# EAGLE design uart_debug_slave_2014 (EAGLE 6.5.0)
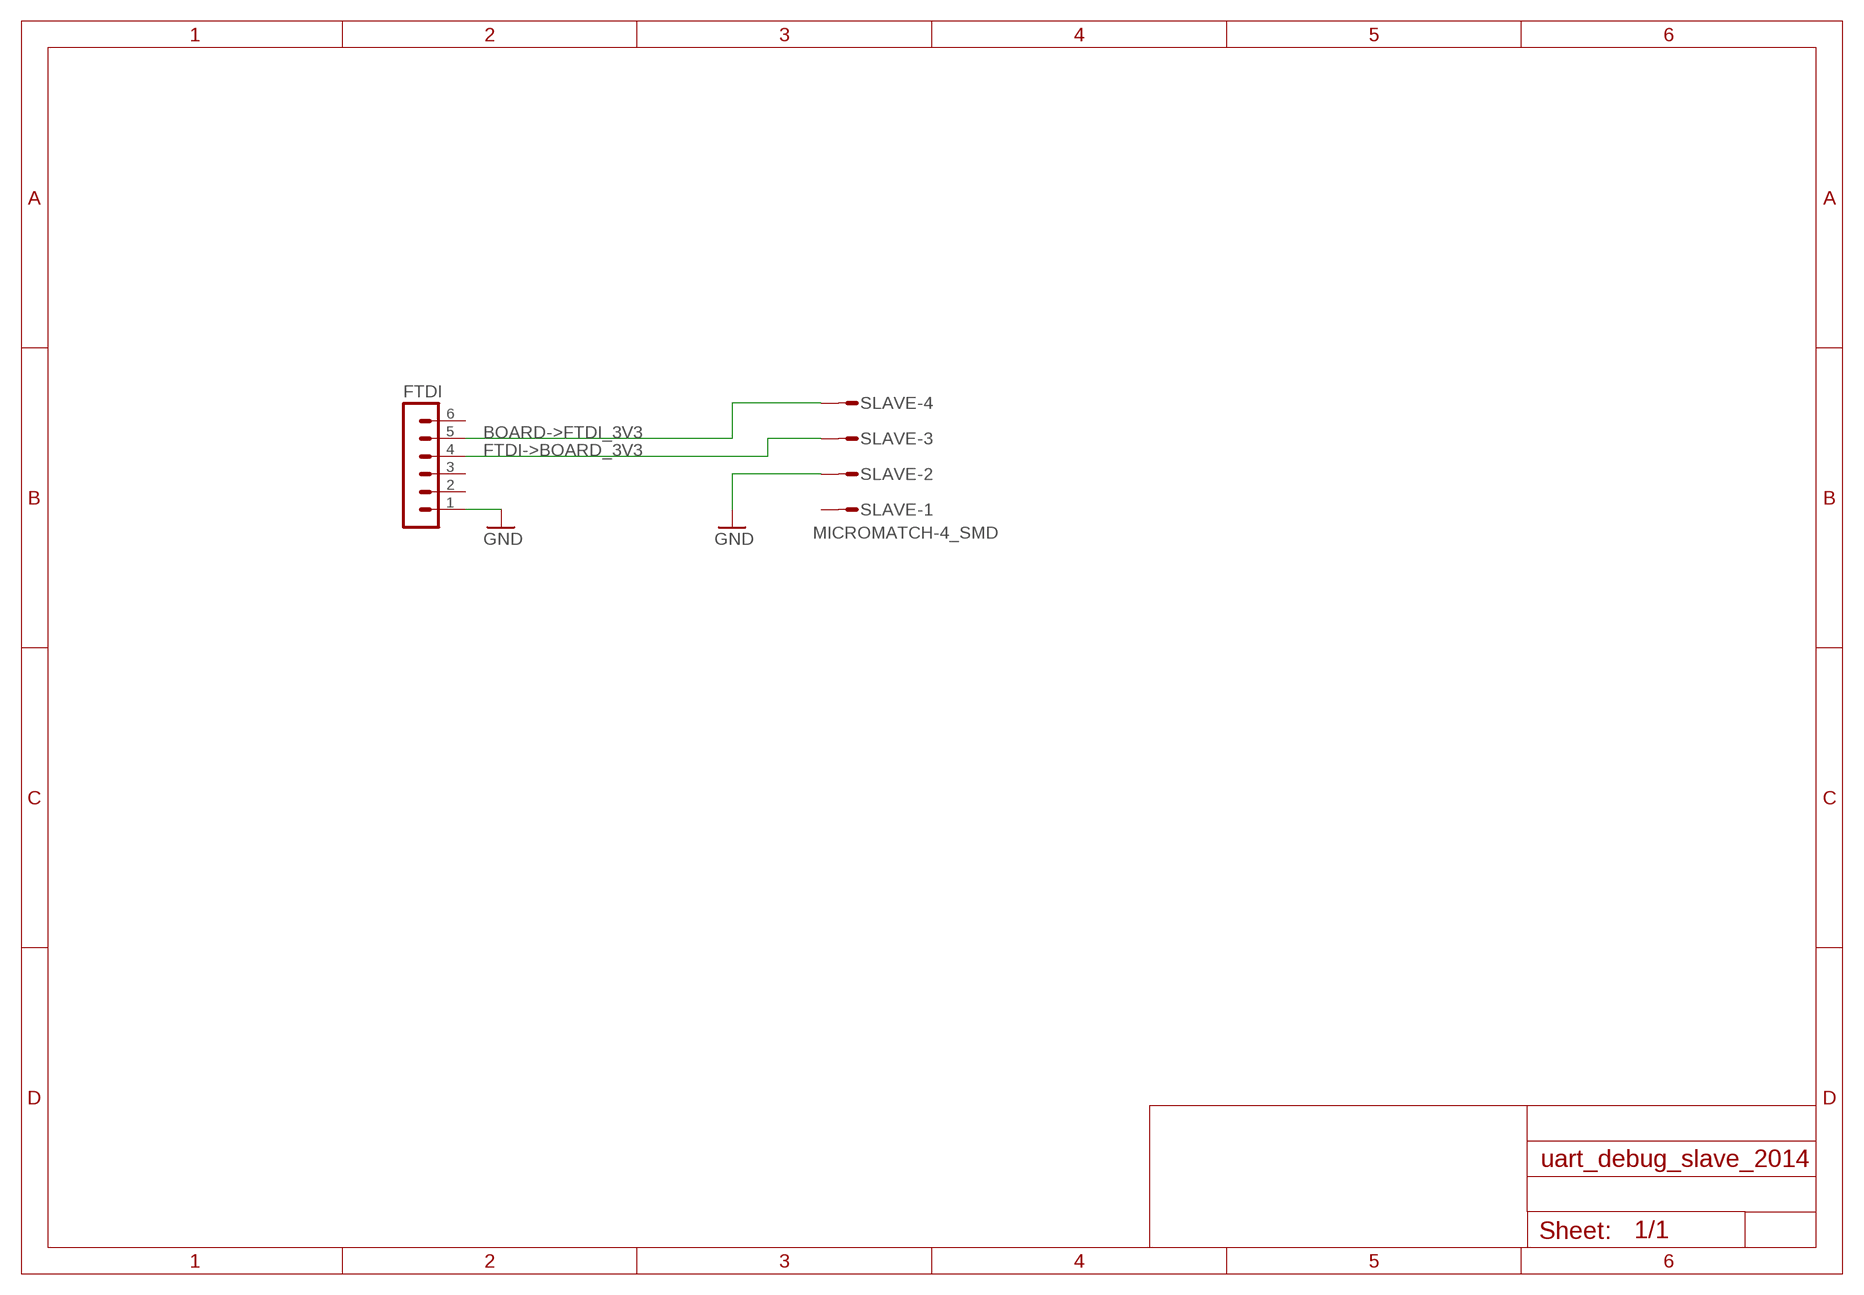
[diagram p0: schematic, sheet 1]

## Parts
FTDI  MA06-1  [MA06-1]
SLAVE  MICROMATCH-4_SMD  [MICROMATCH-4_SMD]

## Nets
BOARD->FTDI_3V3: FTDI.5 SLAVE.4
FTDI->BOARD_3V3: FTDI.4 SLAVE.3
GND: FTDI.1 SLAVE.2
Unconnected: FTDI.2 FTDI.3 FTDI.6 SLAVE.1

## Library data of the parts
FTDI = con-lstb:MA06-1: PIN HEADER; OC_FARNELL: unknown; OC_NEWARK: unknown
SLAVE = robotter_connector:MICROMATCH-4_SMD: Ref FN : 1865094; RS: 366-1721

## Board
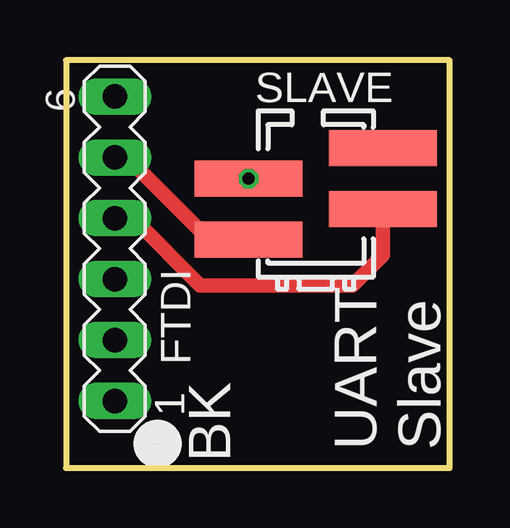
[diagram p1: board, top side]
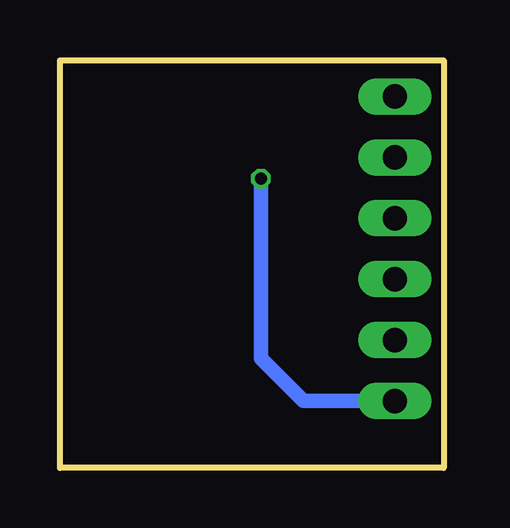
[diagram p2: board, bottom side, seen from below]

Size 16 x 17 mm. Coordinates in mm from the lower left corner, seen from the top.
Outline: 0,0 16,0 16,17 0,17 0,0
Copper layers (1*16): Top 0.035mm / dielectric 1.6mm / Bottom 0.035mm
Design rules "SeeedStudio_DRU_2layer": minimum track width 6mil, minimum drill 12mil, track to track 6mil, track to pad 6mil, pad to pad 6mil, via to via 6mil, smd to smd 0mil, copper to edge 10mil, drill to drill 10mil, minimum pad ring 6mil, minimum via ring 6mil, stop-mask expansion 2mil, vias tented up to drill 25mil, thermal gap 10mil

### Footprints (pad centres in the part's own frame; a part is rotated, then mirrored left to right if it is on the bottom)
MA06-1 = drill 1.016 long: 1 -6.35,0; 2 -3.81,0; 3 -1.27,0; 4 1.27,0; 5 3.81,0; 6 6.35,0
MICROMATCH-4_SMD = smd 1.5 x 4.5: 1 1.905,-2.794; 2 0.635,2.794; 3 -0.635,-2.794; 4 -1.905,2.794

### Placement (x,y rotation side)
FTDI  2.03,9.14 90 top
SLAVE  10.41,11.43 90 top

### Tracks (layer width: path | path; a pad name or v marks a point on that pad's centre or on a via)
BOARD->FTDI_3V3
  Top 0.61: SLAVE.4 5.97,9.53 2.54,12.95 FTDI.5
FTDI->BOARD_3V3
  Top 0.61: FTDI.4 2.79,10.41 5.59,7.62 11.94,7.62 13.21,8.89 SLAVE.3
GND  (via drill 0.5)
  Top 0.61: SLAVE.2 6.48,12.06 6.35,11.94 7.49,11.94 SLAVE.2
  Bottom 0.61: FTDI.1 5.84,2.79 7.62,4.57 SLAVE.2
  other vias: 7.62,12.06

### Text on the board
tPlace: UART / Slave | BK